# Altium schematic sheet tmc4671_eval.SchDoc: {Наименование}
size 420 x 297 mm; DocumentNumber: НРДЦ.ХХХХХХ.ХХХ ХХ; SheetNumber: 4; SheetTotal: 7; PageSetup: Record=PageOptions|CenterHorizontal=False|CenterVertical=False|PrintScale=0.95|XCorrection=0.00|YCorrection=0.00|PrintKind=1|BorderSize=5000000|LeftOffset=0|BottomOffset=0|Orientation=1|PaperLength=1000|PaperWidth=1000|Scale=100|PaperSource=15|PrintQuality=600|MediaType=1|DitherType=10|PaperKind=A4|PrintScaleMode=1; Rule: PcbType=ProtelPcb
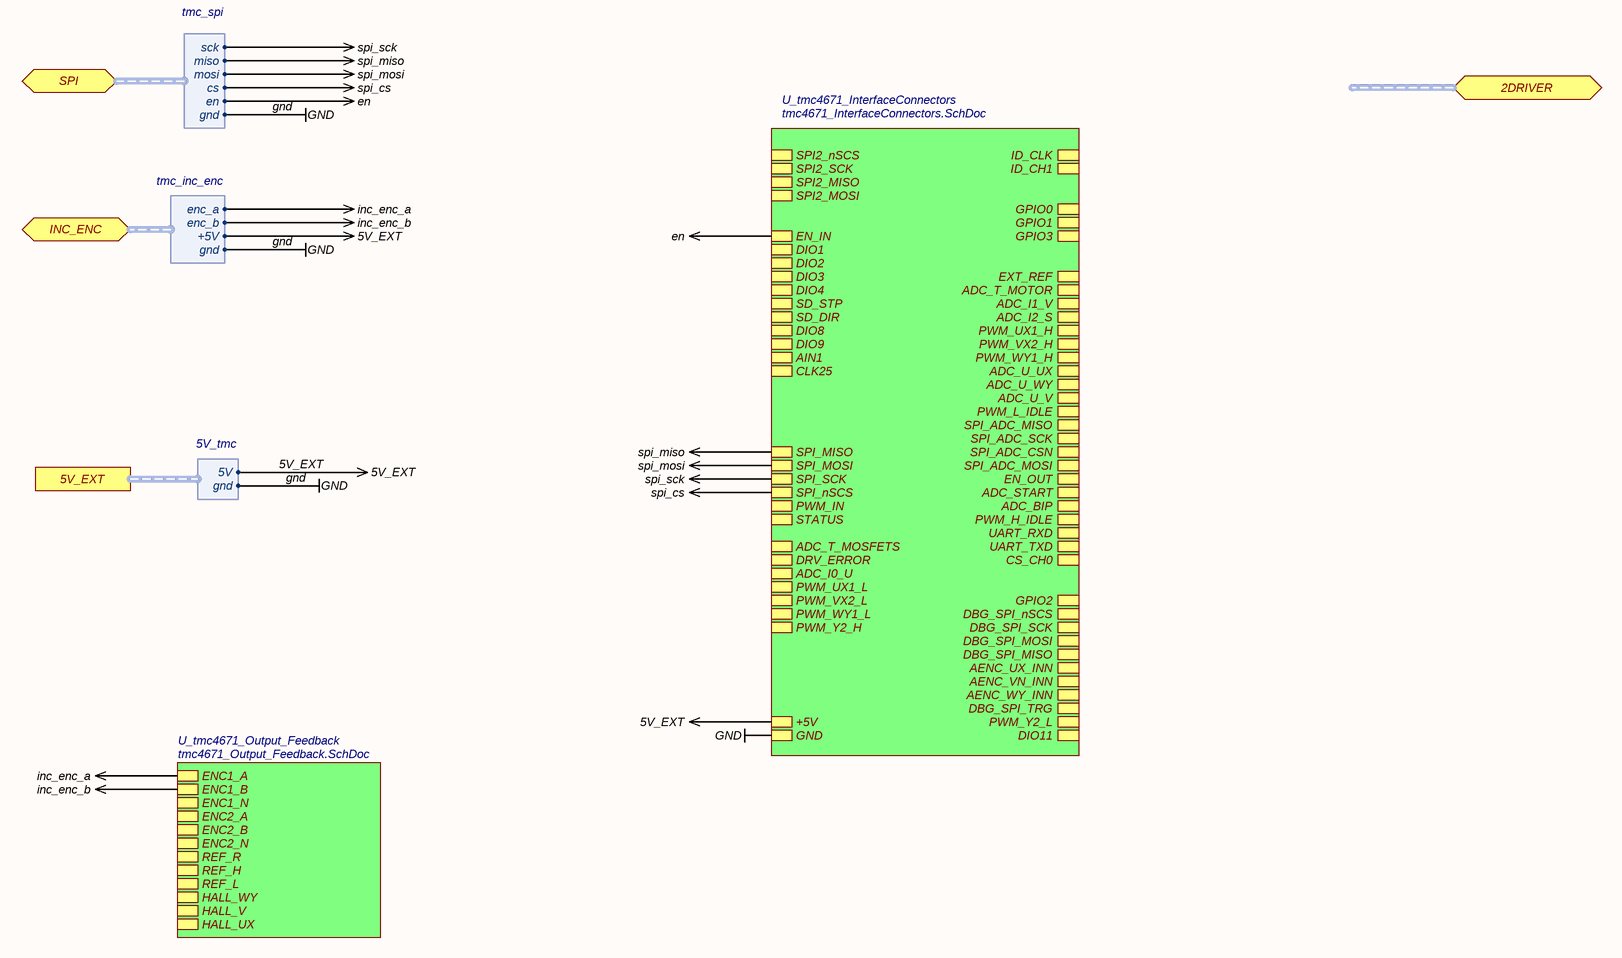
[diagram p0: tmc4671_eval.SchDoc]

## Sub-sheets
U_tmc4671_InterfaceConnectors = tmc4671_InterfaceConnectors.SchDoc: EN_IN, DIO1, DIO2, DIO3, DIO4, SD_STP, SD_DIR, DIO8, DIO9, AIN1, CLK25, GPIO3, SPI_MISO, SPI_MOSI, SPI_SCK, SPI_nSCS, PWM_IN, STATUS, ADC_T_MOSFETS, DRV_ERROR, ADC_I0_U, PWM_UX1_L, PWM_VX2_L, PWM_WY1_L, PWM_Y2_H, EXT_REF, ADC_T_MOTOR, ADC_I1_V, ADC_I2_S, PWM_UX1_H, PWM_VX2_H, PWM_WY1_H, ADC_U_UX, ADC_U_WY, ADC_U_V, PWM_L_IDLE, SPI_ADC_MISO, SPI_ADC_SCK, SPI_ADC_CSN, SPI_ADC_MOSI, EN_OUT, ADC_START, ADC_BIP, PWM_H_IDLE, UART_RXD, UART_TXD, CS_CH0, GPIO2, DBG_SPI_nSCS, DBG_SPI_SCK, DBG_SPI_MOSI, DBG_SPI_MISO, AENC_UX_INN, AENC_VN_INN, AENC_WY_INN, DBG_SPI_TRG, PWM_Y2_L, DIO11, GND, +5V, SPI2_MOSI, ID_CLK, GPIO1, ID_CH1, GPIO0, SPI2_nSCS, SPI2_SCK, SPI2_MISO
U_tmc4671_Output_Feedback = tmc4671_Output_Feedback.SchDoc: ENC1_A, ENC1_B, ENC1_N, ENC2_A, ENC2_B, ENC2_N, REF_R, REF_H, REF_L, HALL_WY, HALL_V, HALL_UX

## Ports
2DRIVER (bidir, harness tmc_spi), 5V_EXT (harness 5V_tmc), INC_ENC (bidir, harness tmc_inc_enc), SPI (bidir, harness tmc_spi)

## Harnesses
5V_tmc: 5V, gnd
tmc_spi: sck, miso, gnd, mosi, en, cs
tmc_inc_enc: enc_a, enc_b, +5V, gnd

## Nets
5V_EXT: sheet U_tmc4671_InterfaceConnectors/+5V, port 5V_EXT.5V, port INC_ENC.+5V
en: sheet U_tmc4671_InterfaceConnectors/EN_IN, port SPI.en
gnd: sheet U_tmc4671_InterfaceConnectors/GND, port 5V_EXT.gnd, port SPI.gnd, port INC_ENC.gnd
inc_enc_a: sheet U_tmc4671_Output_Feedback/ENC1_A, port INC_ENC.enc_a
inc_enc_b: sheet U_tmc4671_Output_Feedback/ENC1_B, port INC_ENC.enc_b
spi_cs: sheet U_tmc4671_InterfaceConnectors/SPI_nSCS, port SPI.cs
spi_miso: sheet U_tmc4671_InterfaceConnectors/SPI_MISO, port SPI.miso
spi_mosi: sheet U_tmc4671_InterfaceConnectors/SPI_MOSI, port SPI.mosi
spi_sck: sheet U_tmc4671_InterfaceConnectors/SPI_SCK, port SPI.sck

## Notes on the sheet
- Подп. и дата
- Инв. № дубл.
- Взам. инв. №
- Инв. № подл.
- Лист
- Изм.
- № докум.
- Подп.
- Дата
- Копировал
- Формат А3